# Altium project Espressoplatine.PrjPcb
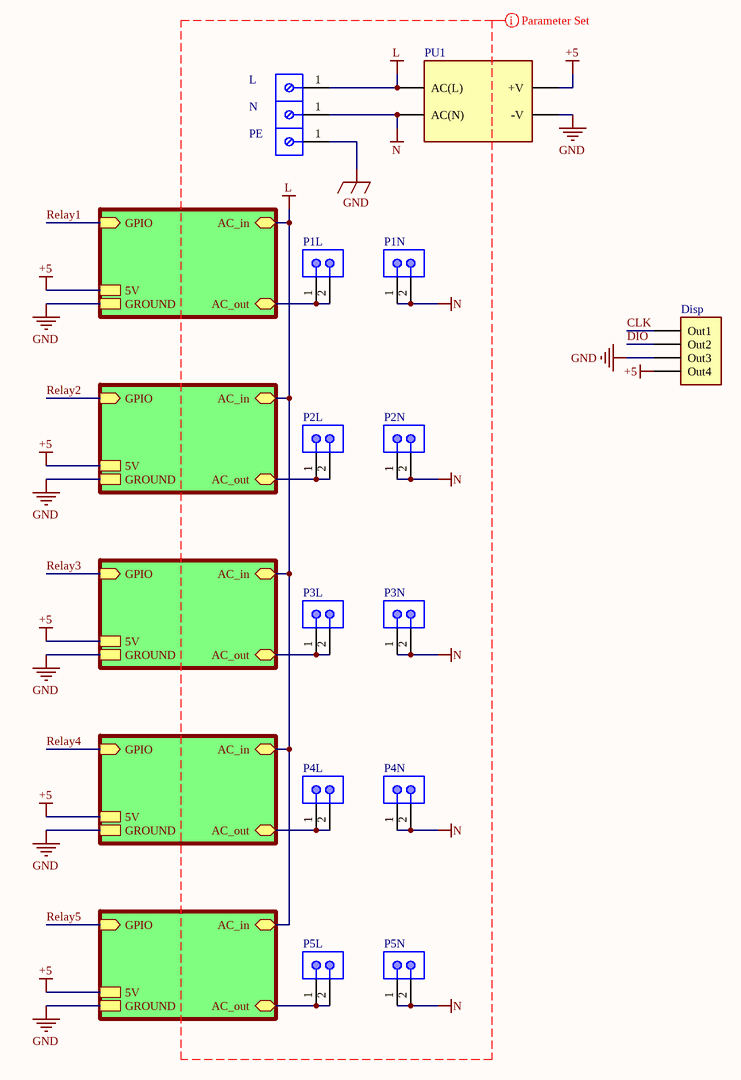
[diagram p0: Sheet1.SchDoc]
2 sheets, 35 parts. Net scope: hierarchical (ports join the sheet entries above them; power ports are global).
Sheets:
  Sheet1.SchDoc
    U_Relay = Relay.SchDoc
    U_Relay = Relay.SchDoc
    U_Relay = Relay.SchDoc
    U_Relay = Relay.SchDoc
    U_Relay = Relay.SchDoc

## Sheet Sheet1.SchDoc
size A3; SheetNumber: 1; SheetTotal: 2

### Parts
Disp  4Pin Connector  [4Pin Connector]  (value not drawn)
L  691102810001  [691102810001]  (value not drawn)
N  691102810001  [691102810001]  (value not drawn)
P1L  1287-ST  [KSTN-1287-ST]  (value not drawn)
P1N  1287-ST  [KSTN-1287-ST]  (value not drawn)
P2L  1287-ST  [KSTN-1287-ST]  (value not drawn)
P2N  1287-ST  [KSTN-1287-ST]  (value not drawn)
P3L  1287-ST  [KSTN-1287-ST]  (value not drawn)
P3N  1287-ST  [KSTN-1287-ST]  (value not drawn)
P4L  1287-ST  [KSTN-1287-ST]  (value not drawn)
P4N  1287-ST  [KSTN-1287-ST]  (value not drawn)
P5L  1287-ST  [KSTN-1287-ST]  (value not drawn)
P5N  1287-ST  [KSTN-1287-ST]  (value not drawn)
PE  691102810001  [691102810001]  (value not drawn)
PU1  Netzteil  [Netzteil]  (value not drawn)

### Sub-sheets
U_Relay = Relay.SchDoc: AC_in (bidir), AC_out (bidir), GROUND, GPIO (in), 5V
U_Relay = Relay.SchDoc: AC_in (bidir), AC_out (bidir), GROUND, GPIO (in), 5V
U_Relay = Relay.SchDoc: AC_in (bidir), AC_out (bidir), GROUND, GPIO (in), 5V
U_Relay = Relay.SchDoc: AC_in (bidir), AC_out (bidir), GROUND, GPIO (in), 5V
U_Relay = Relay.SchDoc: AC_in (bidir), AC_out (bidir), GROUND, GPIO (in), 5V

### Nets
+5: Disp.4(Out4) PU1.VPOS(+V) ; sheet U_Relay/5V, sheet U_Relay/5V, sheet U_Relay/5V, sheet U_Relay/5V, sheet U_Relay/5V
GND: Disp.3(Out3) PE.1 PU1.VNEG(-V) ; sheet U_Relay/GROUND, sheet U_Relay/GROUND, sheet U_Relay/GROUND, sheet U_Relay/GROUND, sheet U_Relay/GROUND
L: L.1 PU1.AC/L(AC(L)) ; sheet U_Relay/AC_in, sheet U_Relay/AC_in, sheet U_Relay/AC_in, sheet U_Relay/AC_in, sheet U_Relay/AC_in
N: N.1 P1N.1 P1N.2 P2N.1 P2N.2 P3N.1 P3N.2 P4N.1 P4N.2 P5N.1 P5N.2 PU1.AC/N(AC(N))
CLK: Disp.1(Out1)
DIO: Disp.2(Out2)
Net1_U_Relay#1_2: P1L.1 P1L.2 ; sheet U_Relay/AC_out
Net1_U_Relay#2_2: P2L.1 P2L.2 ; sheet U_Relay/AC_out
Net1_U_Relay#3_2: P3L.1 P3L.2 ; sheet U_Relay/AC_out
Net1_U_Relay#4_2: P4L.1 P4L.2 ; sheet U_Relay/AC_out
Net1_U_Relay#5_2: P5L.1 P5L.2 ; sheet U_Relay/AC_out

### Layout directives
net class HV: GND, L, N

### Library data of the parts
L N PE = CMP-03913-134028450-1: 691102810001 Pitch mm = 10 / Wire Connection Method = Screw / Poles = 1 / PCB Mounting Method = THT / Wire Size AWG Max. AWG = 22...; NexarPartId: 134028450
P1L P1N P2L P2N P3L P3N P4L P4N P5L P5N = CMP-2000-05485-1: PC Sturdi-Mount Quick-Fit Terminal, Vertical, Male, 2-Pin THD, Bulk; Manufacturer: Keystone; Angle: Straight; Insulation Type: Non-Insulated; Material, Contact: Brass; Tab Fit: 0.25; Finish Plating: TinPlate; Mounting Hole Size: 0.052; Finish: Tin; Primary Type: QuickDisconnect; Standards: ULListed; Contact Plating: Tin; Datasheet Version: Rev. C, 08/2012; Package URL: http://www.keyelco.com/product-pdf.cfm?p=1859; Length, Overall: 0.552"; Terminal Style: PCBMale; Mounting: VERTICAL; Gender: Male; Package Description: 2-Leads Quick-Fit Terminal, Pitch 5.08 mm; Type: Tab; Manufacturer URL: http://www.keyelco.com/; Terminal Type: Quick-Fit; Orientation: VERTICAL-Sturdi-Mount; Material: .032[.81]Brass; Diameter, Hole: 0.052in.; Mounting Technology: ThroughHole; Datasheet URL: http://www.keyelco.com/product-pdf.cfm?p=1859; Width, Overall: 0.312"; Termination: Solder; Package Reference: 1287-ST; Mount Angle: Straight
PU1 = Netzteil: IRM-05-5

## Sheet Relay.SchDoc
size A4; SheetNumber: 2; SheetTotal: 2
Used 5 times, as channels U_Relay, U_Relay, U_Relay, U_Relay, U_Relay. Parts and nets are listed once, with the designators drawn on the sheet.
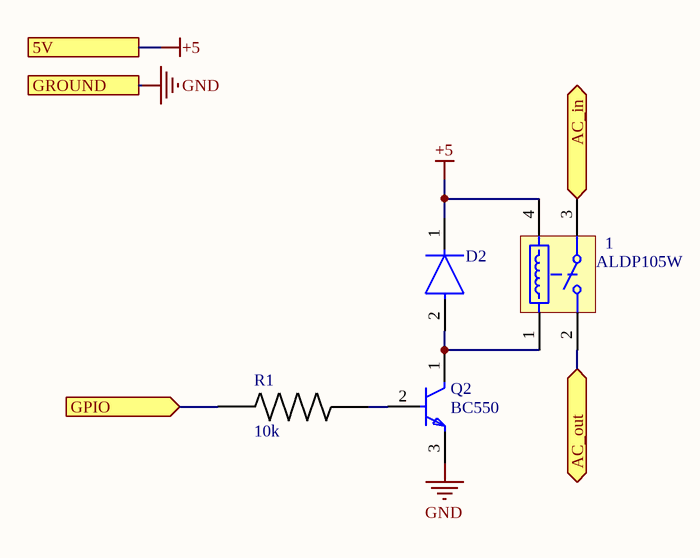
[diagram p1: Relay.SchDoc]

### Parts
1  ALDP105W  [PNSC-LD-P-4-2050x720x1530_V]
D2  1N4001-E3/73  [FP-1N4001-E3-73-MFG]  (value not drawn)
Q2  BC550  [FP-135AN-MFG]
R1  10k  [thd res]

### Ports
5V, AC_in (bidir), AC_out (bidir), GPIO (in), GROUND

### Nets
+5: 1.4 D2.1(C) ; port 5V
GND: Q2.3(E) ; port GROUND
AC_in: 1.3(COM) ; port AC_in
AC_out: 1.2(NO) ; port AC_out
GPIO: R1.1 ; port GPIO
Net1_1: 1.1 D2.2(A) Q2.1(C)
NetQ2_2: Q2.2(B) R1.2

### Channels
U_Relay: designators   1=1_U_Relay#1 D2=D2_U_Relay#1 Q2=Q2_U_Relay#1 R1=R1_U_Relay#1; ports 5V=+5 AC_in=L AC_out=Net1_U_Relay#1_2 GPIO=Relay1 GROUND=GND
U_Relay: designators   1=1_U_Relay#2 D2=D2_U_Relay#2 Q2=Q2_U_Relay#2 R1=R1_U_Relay#2; ports 5V=+5 AC_in=L AC_out=Net1_U_Relay#2_2 GPIO=Relay2 GROUND=GND
U_Relay: designators   1=1_U_Relay#3 D2=D2_U_Relay#3 Q2=Q2_U_Relay#3 R1=R1_U_Relay#3; ports 5V=+5 AC_in=L AC_out=Net1_U_Relay#3_2 GPIO=Relay3 GROUND=GND
U_Relay: designators   1=1_U_Relay#4 D2=D2_U_Relay#4 Q2=Q2_U_Relay#4 R1=R1_U_Relay#4; ports 5V=+5 AC_in=L AC_out=Net1_U_Relay#4_2 GPIO=Relay4 GROUND=GND
U_Relay: designators   1=1_U_Relay#5 D2=D2_U_Relay#5 Q2=Q2_U_Relay#5 R1=R1_U_Relay#5; ports 5V=+5 AC_in=L AC_out=Net1_U_Relay#5_2 GPIO=Relay5 GROUND=GND

### Library data of the parts
1 = CMP-1503-00163-1: LD-P Relays, 5 V Coil Voltage, 200 mW Nominal Operating Power, -40 to 85 degC, 4-Pin LD-P, Carton, Case, RoHS; Manufacturer: Panasonic; Mechanical Life(Min.operation): 5x10^6; Max Switching Current: 5 A AC, 3 A DC; Pb-Free: True; Electrical Life: 2x10^5; Coil Voltage: 5 V; Max Switching Voltage: 277 V AC, 30 V DC; Nominal Operating Power: 200 mW; ComponentLink3Description: Package Specification; PackageVersion: ASCTB193E, 02/2014; ComponentLink1URL: http://www3.panasonic.biz/ac/ae/index.jsp; Mounting Technology: Through Hole; Packing: Carton, Case; PackageDescription: 4-Pin Through Hole Terminal Package, Body 20.5 x 7.2 mm; ComponentLink2Description: Datasheet; RoHS: True; Series: LD-P Relays; ComponentLink1Description: Manufacturer URL; ComponentLink2URL: http://www3.panasonic.biz/ac/e_download/control/relay/power/catalog/mech_eng_ldp.pdf?f_cd=300242; PartNumber: ALDP105W; DatasheetVersion: 201402-T; PackageReference: LD-P-4-2050x720x1530; ComponentLink3URL: http://www3.panasonic.biz/ac/e_download/control/relay/power/catalog/mech_eng_ldp.pdf?f_cd=300242
D2 = CMP-02540-000001-1: DIODE GEN PURP 50V 1A DO204AL; Manufacturer: Vishay; Max Surge Forward Current: 30A; Value: 15pF; Peak Reverse Current: 5uA; Description: Diode Standard 50V 1A Through Hole DO-204AL (DO-41); Max Junction Temp: +150°C; Lead Free: Yes; Manufacturer Part Number: 1N4001-E3/73; Height: 2.7mm; Digikey Description: DIODE GEN PURP 50V 1A DO204AL; Reverse Voltage: 50V; Package: 1N4001-E3/73; RoHS: TRUE; Temperature: -50°C to +150°C; Device Class L2: Diodes; Forward Current: 1A; Max Repetitive Reverse Voltage: 50V; Device Class L1: Discrete Semiconductors; Device Class L3: Rectifier Diodes; Capacitance: 15pF; Temperature Range High: +150°C; Category: Diode; Ipc Land Pattern Name: DIOPA1088W105L520D270; ComponentLink2URL: http://www.vishay.com/docs/88503/1n4001.pdf; Octopart: https://octopart.com/1n4001-e3%2F73-vishay-42330130; Automotive: No; ComponentLink2Description: Datasheet; Temperature Range Low: -50°C; Mouser Description: Rectifiers Vr/50V Io/1A
Q2 = CMP-00278-13139640-1: BC550 Bulk Through Hole NPN Single Bipolar (BJT) Transistor 110 @ 2mA 5V 100mA 500mW 300MHz; Collector Emitter Saturation Voltage: 250mV; Number of Elements: 1; Collector Base Voltage (VCBO): 50V; hFE Min: 110; Collector Emitter Voltage (VCEO): 45V; Max Junction Temperature (Tj): 150°C; Number of Pins: 3; Mount: Through Hole; NexarPartId: 13139640; Lead Free: Lead Free; Gain Bandwidth Product: 300MHz; Case/Package: TO-92; RoHS: Compliant; REACH SVHC: No SVHC; Polarity: NPN; Frequency: 300MHz; Termination: Through Hole; Voltage Rating (DC): 45V; Power Dissipation: 500mW; Max Collector Current: 100mA; Min Operating Temperature: -65°C; Packaging: Bulk; Transition Frequency: 300MHz; Weight: 201mg; Element Configuration: Single; Current Rating: 100mA; Max Power Dissipation: 500mW; Emitter Base Voltage (VEBO): 5V; Collector Emitter Breakdown Voltage: 45V; Max Operating Temperature: 150°C; Height: 5.33mm
R1 = thd res

## Nets that join several sheets
+5: Sheet1 (Disp.4 PU1.VPOS), U_Relay (1_U_Relay#1.4 D2_U_Relay#1.1), U_Relay (1_U_Relay#2.4 D2_U_Relay#2.1), U_Relay (1_U_Relay#3.4 D2_U_Relay#3.1), U_Relay (1_U_Relay#4.4 D2_U_Relay#4.1), U_Relay (1_U_Relay#5.4 D2_U_Relay#5.1)
GND: Sheet1 (Disp.3 PE.1 PU1.VNEG), U_Relay (Q2_U_Relay#1.3), U_Relay (Q2_U_Relay#2.3), U_Relay (Q2_U_Relay#3.3), U_Relay (Q2_U_Relay#4.3), U_Relay (Q2_U_Relay#5.3)
L: Sheet1 (L.1 PU1.AC/L), U_Relay (1_U_Relay#1.3), U_Relay (1_U_Relay#2.3), U_Relay (1_U_Relay#3.3), U_Relay (1_U_Relay#4.3), U_Relay (1_U_Relay#5.3)
Net1_U_Relay#1_2: Sheet1 (P1L.1 P1L.2), U_Relay (1_U_Relay#1.2)
Net1_U_Relay#2_2: Sheet1 (P2L.1 P2L.2), U_Relay (1_U_Relay#2.2)
Net1_U_Relay#3_2: Sheet1 (P3L.1 P3L.2), U_Relay (1_U_Relay#3.2)
Net1_U_Relay#4_2: Sheet1 (P4L.1 P4L.2), U_Relay (1_U_Relay#4.2)
Net1_U_Relay#5_2: Sheet1 (P5L.1 P5L.2), U_Relay (1_U_Relay#5.2)